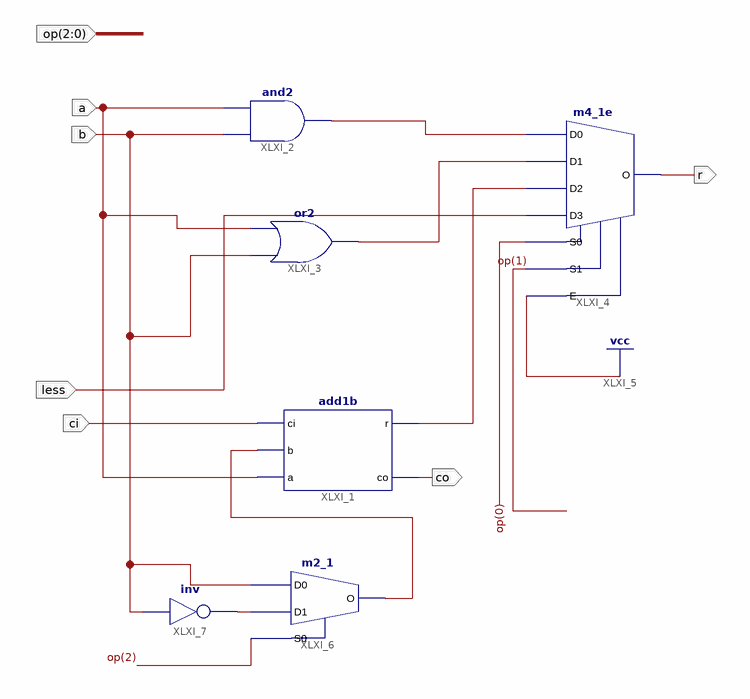
[diagram p0: schematic sheet 1]
// Xilinx ISE schematic alu1b.sch (spartan3e) as structural Verilog: 6 symbols, 7 ports
module alu1b (
  input  a,
  input  ci,
  input  [2:0] op,
  input  b,
  input  less,
  output r,
  output co
);

  wire XLXN_8, XLXN_9, XLXN_10, XLXN_18, XLXN_21;

  add1b XLXI_1 (.ci(ci), .b(XLXN_21), .a(a), .r(XLXN_10), .co(co));
  and XLXI_2 (XLXN_8, b, a);
  or XLXI_3 (XLXN_9, b, a);
  m4_1e XLXI_4 (.D0(XLXN_8), .D1(XLXN_9), .D2(XLXN_10), .D3(less), .E(1'b1), .S0(op[0]), .S1(op[1]), .O(r));
  m2_1 XLXI_6 (.D0(b), .D1(XLXN_18), .S0(op[2]), .O(XLXN_21));
  not XLXI_7 (XLXN_18, b);
endmodule
